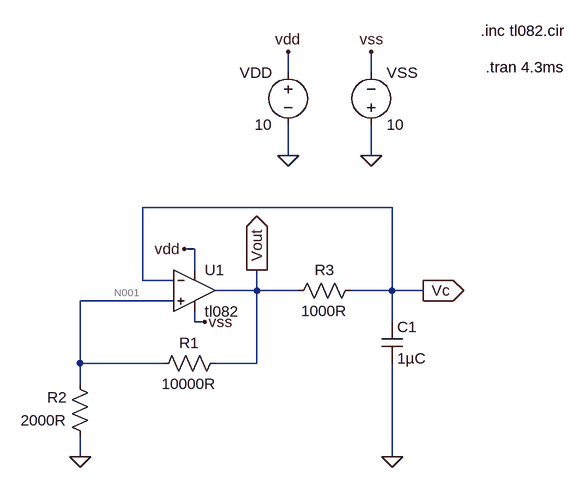
[diagram p0: schematic astabile_kippstufe.asc]
astabile_kippstufe.asc, the LTspice schematic file:
Version 4
SHEET 1 948 680
WIRE -64 -176 -64 -208
WIRE 64 -176 64 -208
WIRE -64 -48 -64 -96
WIRE 64 -48 64 -96
WIRE 96 32 -288 32
WIRE -208 96 -224 96
WIRE -208 128 -208 96
WIRE -288 144 -288 32
WIRE -240 144 -288 144
WIRE -112 160 -112 128
WIRE -112 160 -176 160
WIRE -48 160 -112 160
WIRE 96 160 96 32
WIRE 96 160 32 160
WIRE 144 160 96 160
WIRE -240 176 -384 176
WIRE -208 208 -208 192
WIRE -192 208 -208 208
WIRE 96 208 96 160
WIRE -384 272 -384 176
WIRE -256 272 -384 272
WIRE -112 272 -112 160
WIRE -112 272 -176 272
WIRE -384 304 -384 272
WIRE -384 416 -384 384
WIRE 96 416 96 272
FLAG -64 -48 0
FLAG 64 -48 0
FLAG -64 -208 vdd
FLAG -224 96 vdd
FLAG 64 -208 vss
FLAG -192 208 vss
FLAG -384 416 0
FLAG 96 416 0
FLAG -112 128 Vout
IOPIN -112 128 Out
FLAG 144 160 Vc
IOPIN 144 160 Out
SYMBOL voltage -64 -192 M0
SYMATTR InstName VDD
SYMATTR Value 10
SYMBOL voltage 64 -80 M180
WINDOW 0 24 96 Left 2
WINDOW 3 24 16 Left 2
SYMATTR InstName VSS
SYMATTR Value 10
SYMBOL Opamps\\opamp2 -208 96 R0
SYMATTR InstName U1
SYMATTR Value tl082
SYMBOL res -272 288 R270
WINDOW 0 32 56 VTop 2
WINDOW 3 0 56 VBottom 2
SYMATTR InstName R1
SYMATTR Value 10000R
SYMBOL res -368 400 R180
WINDOW 0 36 76 Left 2
WINDOW 3 36 40 Left 2
SYMATTR InstName R2
SYMATTR Value 2000R
SYMBOL res 48 144 R90
WINDOW 0 0 56 VBottom 2
WINDOW 3 32 56 VTop 2
SYMATTR InstName R3
SYMATTR Value 1000R
SYMBOL cap 80 208 R0
SYMATTR InstName C1
SYMATTR Value 1µC
TEXT 232 -240 Left 2 !.inc tl082.cir
TEXT 240 -184 Left 2 !.tran 4.3ms

The netlist it stands for:
* astabile_kippstufe.asc
VDD vdd 0 10
VSS 0 vss 10
XU1 N001 Vc vdd vss Vout tl082  ; pins In+ In- V+ V- OUT
R1 N001 Vout 10000R
R2 0 N001 2000R
R3 Vc Vout 1000R
C1 Vc 0 1µC
.inc tl082.cir
.tran 4.3ms
.backanno
.end

* Results of the author's LTspice run, read from the files saved beside the schematic
* Operating Point, zero values left out:
*   V(vdd) = 10 V
*   V(vss) = -10 V
*   V(vout) = 13.13 µV
*   V(vc) = 13.09 µV
*   V(n001) = 2.122 µV
*   I(R3) = -40.05 pA
*   I(R2) = -1.061 nA
*   I(R1) = -1.101 nA
*   I(Vss) = -9.528 mA
*   I(Vdd) = -9.528 mA
*   Ix(u1:1) = 40.05 pA
*   Ix(u1:2) = 40.05 pA
*   Ix(u1:3) = 9.528 mA
*   Ix(u1:4) = -9.528 mA
*   Ix(u1:5) = -1.141 nA
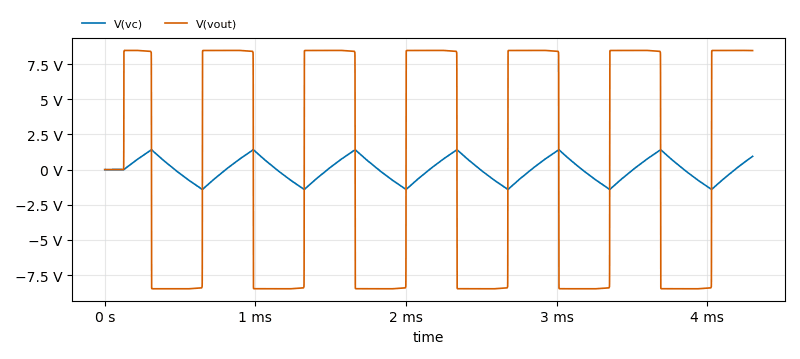
[diagram p1: Transient Analysis of astabile_kippstufe.asc, plotted from the saved traces]
* Transient Analysis, 1 run:
*   V(vc): min -1.414 V, max 1.414 V, average 13.03 mV, rms 839 mV, last 942 mV
*   V(vout): min -8.479 V, max 8.483 V, average 232.2 mV, rms 8.326 V, last 8.469 V